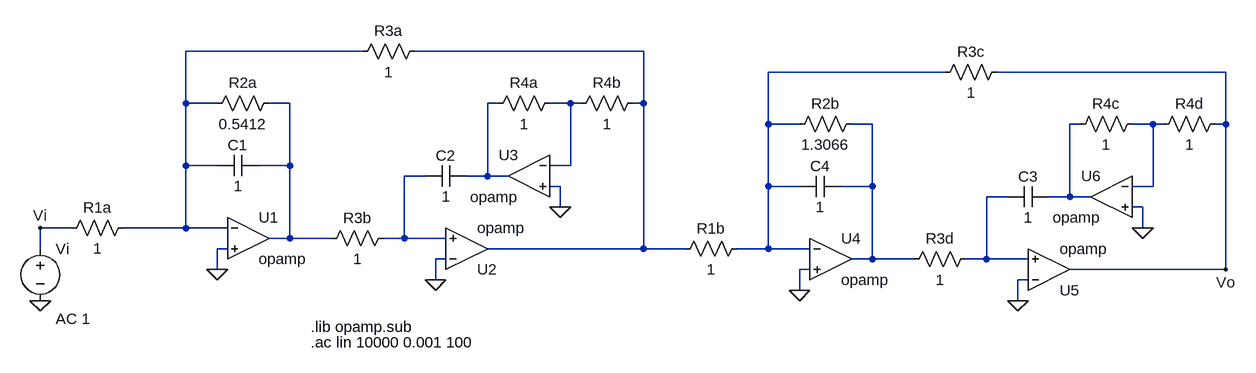
[diagram p0: schematic Simulacion_orden4_LTspice.asc]
Simulacion_orden4_LTspice.asc, the LTspice schematic file:
Version 4
SHEET 1 1792 680
WIRE 432 -80 160 -80
WIRE 864 -80 512 -80
WIRE 1328 -48 1056 -48
WIRE 1760 -48 1408 -48
WIRE 160 0 160 -80
WIRE 208 0 160 0
WIRE 320 0 288 0
WIRE 640 0 624 0
WIRE 752 0 720 0
WIRE 768 0 752 0
WIRE 864 0 864 -80
WIRE 864 0 848 0
WIRE 1056 32 1056 -48
WIRE 1104 32 1056 32
WIRE 1216 32 1184 32
WIRE 1536 32 1520 32
WIRE 1648 32 1616 32
WIRE 1664 32 1648 32
WIRE 1760 32 1760 -48
WIRE 1760 32 1744 32
WIRE 160 96 160 0
WIRE 208 96 160 96
WIRE 320 96 320 0
WIRE 320 96 272 96
WIRE 752 96 752 0
WIRE 752 96 720 96
WIRE 528 112 496 112
WIRE 624 112 624 0
WIRE 624 112 592 112
WIRE 656 112 624 112
WIRE 736 128 720 128
WIRE 1056 128 1056 32
WIRE 1104 128 1056 128
WIRE 1216 128 1216 32
WIRE 1216 128 1168 128
WIRE 1648 128 1648 32
WIRE 1648 128 1616 128
WIRE 1424 144 1392 144
WIRE 1520 144 1520 32
WIRE 1520 144 1488 144
WIRE 1552 144 1520 144
WIRE 736 160 736 128
WIRE 1632 160 1616 160
WIRE -16 192 -64 192
WIRE 160 192 160 96
WIRE 160 192 64 192
WIRE 224 192 160 192
WIRE 1632 192 1632 160
WIRE 320 208 320 96
WIRE 320 208 288 208
WIRE 384 208 320 208
WIRE 496 208 496 112
WIRE 496 208 464 208
WIRE 560 208 496 208
WIRE -64 224 -64 192
WIRE 224 224 208 224
WIRE 864 224 864 0
WIRE 864 224 624 224
WIRE 928 224 864 224
WIRE 1056 224 1056 128
WIRE 1056 224 1008 224
WIRE 1120 224 1056 224
WIRE 560 240 544 240
WIRE 1216 240 1216 128
WIRE 1216 240 1184 240
WIRE 1280 240 1216 240
WIRE 1392 240 1392 144
WIRE 1392 240 1360 240
WIRE 1456 240 1392 240
WIRE 208 256 208 224
WIRE 1120 256 1104 256
WIRE 1760 256 1760 32
WIRE 1760 256 1520 256
WIRE 544 272 544 240
WIRE 1456 272 1440 272
WIRE 1104 288 1104 256
WIRE 1440 304 1440 272
FLAG 208 256 0
FLAG 544 272 0
FLAG 736 160 0
FLAG -64 192 Vi
FLAG -64 304 0
FLAG 1104 288 0
FLAG 1440 304 0
FLAG 1632 192 0
FLAG 1760 256 Vo
SYMBOL res 80 176 R90
WINDOW 0 0 56 VBottom 2
WINDOW 3 32 56 VTop 2
SYMATTR InstName R1a
SYMATTR Value 1
SYMBOL res 304 -16 R90
WINDOW 0 0 56 VBottom 2
WINDOW 3 32 56 VTop 2
SYMATTR InstName R2a
SYMATTR Value 0.5412
SYMBOL res 480 192 R90
WINDOW 0 0 56 VBottom 2
WINDOW 3 32 56 VTop 2
SYMATTR InstName R3b
SYMATTR Value 1
SYMBOL res 736 -16 R90
WINDOW 0 0 56 VBottom 2
WINDOW 3 32 56 VTop 2
SYMATTR InstName R4a
SYMATTR Value 1
SYMBOL res 864 -16 R90
WINDOW 0 0 56 VBottom 2
WINDOW 3 32 56 VTop 2
SYMATTR InstName R4b
SYMATTR Value 1
SYMBOL res 528 -96 R90
WINDOW 0 0 56 VBottom 2
WINDOW 3 32 56 VTop 2
SYMATTR InstName R3a
SYMATTR Value 1
SYMBOL OpAmps\\opamp 256 144 R0
SYMATTR InstName U1
SYMBOL OpAmps\\opamp 592 288 M180
SYMATTR InstName U2
SYMBOL OpAmps\\opamp 688 48 M0
SYMATTR InstName U3
SYMBOL cap 592 96 R90
WINDOW 0 0 32 VBottom 2
WINDOW 3 32 32 VTop 2
SYMATTR InstName C2
SYMATTR Value 1
SYMBOL cap 272 80 R90
WINDOW 0 0 32 VBottom 2
WINDOW 3 32 32 VTop 2
SYMATTR InstName C1
SYMATTR Value 1
SYMBOL voltage -64 208 R0
WINDOW 123 24 124 Left 2
WINDOW 39 0 0 Left 0
SYMATTR Value2 AC 1
SYMATTR InstName Vi
SYMATTR Value ""
SYMBOL res 1200 16 R90
WINDOW 0 0 56 VBottom 2
WINDOW 3 32 56 VTop 2
SYMATTR InstName R2b
SYMATTR Value 1.3066
SYMBOL res 1376 224 R90
WINDOW 0 0 56 VBottom 2
WINDOW 3 32 56 VTop 2
SYMATTR InstName R3d
SYMATTR Value 1
SYMBOL res 1632 16 R90
WINDOW 0 0 56 VBottom 2
WINDOW 3 32 56 VTop 2
SYMATTR InstName R4c
SYMATTR Value 1
SYMBOL res 1760 16 R90
WINDOW 0 0 56 VBottom 2
WINDOW 3 32 56 VTop 2
SYMATTR InstName R4d
SYMATTR Value 1
SYMBOL res 1424 -64 R90
WINDOW 0 0 56 VBottom 2
WINDOW 3 32 56 VTop 2
SYMATTR InstName R3c
SYMATTR Value 1
SYMBOL OpAmps\\opamp 1152 176 R0
SYMATTR InstName U4
SYMBOL OpAmps\\opamp 1488 320 M180
SYMATTR InstName U5
SYMBOL OpAmps\\opamp 1584 80 M0
SYMATTR InstName U6
SYMBOL cap 1488 128 R90
WINDOW 0 0 32 VBottom 2
WINDOW 3 32 32 VTop 2
SYMATTR InstName C3
SYMATTR Value 1
SYMBOL cap 1168 112 R90
WINDOW 0 0 32 VBottom 2
WINDOW 3 32 32 VTop 2
SYMATTR InstName C4
SYMATTR Value 1
SYMBOL res 1024 208 R90
WINDOW 0 0 56 VBottom 2
WINDOW 3 32 56 VTop 2
SYMATTR InstName R1b
SYMATTR Value 1
TEXT 352 344 Left 2 !.lib opamp.sub
TEXT 352 368 Left 2 !.ac lin 10000 0.001 100

The netlist it stands for:
* Simulacion_orden4_LTspice.asc
R1a N001 Vi 1
R2a N004 N001 0.5412
R3b N010 N004 1
R4a N006 N005 1
R4b N002 N006 1
R3a N002 N001 1
XU1 N001 0 N004 opamp Aol=100K GBW=10Meg  ; pins invin noninvin out
XU2 0 N010 N002 opamp Aol=100K GBW=10Meg  ; pins invin noninvin out
XU3 N006 0 N005 opamp Aol=100K GBW=10Meg  ; pins invin noninvin out
C2 N005 N010 1
C1 N004 N001 1
Vi Vi 0 AC 1
R2b N007 N003 1.3066
R3d N011 N007 1
R4c N009 N008 1
R4d Vo N009 1
R3c Vo N003 1
XU4 N003 0 N007 opamp Aol=100K GBW=10Meg  ; pins invin noninvin out
XU5 0 N011 Vo opamp Aol=100K GBW=10Meg  ; pins invin noninvin out
XU6 N009 0 N008 opamp Aol=100K GBW=10Meg  ; pins invin noninvin out
C3 N008 N011 1
C4 N007 N003 1
R1b N003 N002 1
.lib opamp.sub
.ac lin 10000 0.001 100
.backanno
.end